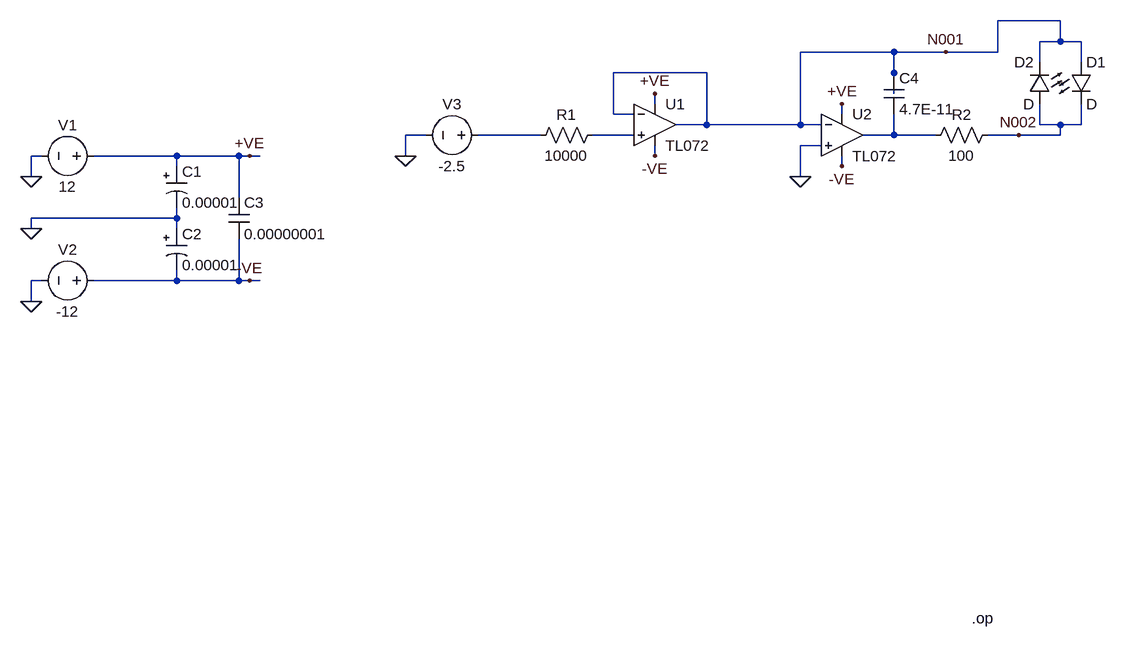
[diagram p0: schematic LED driver.asc]
LED driver.asc, the LTspice schematic file:
Version 4
SHEET 1 1756 888
WIRE 1616 -48 1568 -48
WIRE 1664 -48 1616 -48
WIRE 1664 -16 1664 -48
WIRE 1664 -16 1632 -16
WIRE 1696 -16 1664 -16
WIRE 1408 0 1264 0
WIRE 1488 0 1408 0
WIRE 1568 0 1568 -48
WIRE 1568 0 1488 0
WIRE 1632 16 1632 -16
WIRE 1696 16 1696 -16
WIRE 1120 32 976 32
WIRE 1408 32 1408 0
WIRE 1408 64 1408 32
WIRE 1040 80 1040 64
WIRE 976 96 976 32
WIRE 1008 96 976 96
WIRE 1328 96 1328 80
WIRE 1120 112 1120 32
WIRE 1120 112 1072 112
WIRE 1264 112 1264 0
WIRE 1264 112 1120 112
WIRE 1296 112 1264 112
WIRE 1632 112 1632 80
WIRE 1664 112 1632 112
WIRE 1696 112 1696 80
WIRE 1696 112 1664 112
WIRE 688 128 656 128
WIRE 864 128 768 128
WIRE 1008 128 944 128
WIRE 1408 128 1408 96
WIRE 1408 128 1360 128
WIRE 1472 128 1408 128
WIRE 1600 128 1552 128
WIRE 1616 128 1600 128
WIRE 1664 128 1664 112
WIRE 1664 128 1616 128
WIRE 1296 144 1264 144
WIRE 96 160 80 160
WIRE 304 160 176 160
WIRE 400 160 304 160
WIRE 416 160 400 160
WIRE 432 160 416 160
WIRE 656 160 656 128
WIRE 1040 160 1040 144
WIRE 304 176 304 160
WIRE 1328 176 1328 160
WIRE 80 192 80 160
WIRE 1264 192 1264 144
WIRE 400 224 400 160
WIRE 304 256 304 240
WIRE 304 256 80 256
WIRE 80 272 80 256
WIRE 304 272 304 256
WIRE 96 352 80 352
WIRE 304 352 304 336
WIRE 304 352 176 352
WIRE 400 352 400 288
WIRE 400 352 304 352
WIRE 416 352 400 352
WIRE 432 352 416 352
WIRE 80 384 80 352
FLAG 80 192 0
FLAG 80 384 0
FLAG 80 272 0
FLAG 416 160 +VE
FLAG 416 352 -VE
FLAG 656 160 0
FLAG 1328 80 +VE
FLAG 1328 176 -VE
FLAG 1040 64 +VE
FLAG 1040 160 -VE
FLAG 1264 192 0
FLAG 1488 0 N001
FLAG 1600 128 N002
DATAFLAG 1616 128 "$"
DATAFLAG 1616 -48 "$"
SYMBOL voltage 192 160 R90
WINDOW 0 -32 56 VBottom 2
WINDOW 3 32 56 VTop 2
SYMATTR InstName V1
SYMATTR Value 12
SYMBOL voltage 192 352 R90
WINDOW 0 -32 56 VBottom 2
WINDOW 3 32 56 VTop 2
SYMATTR InstName V2
SYMATTR Value -12
SYMBOL polcap 288 176 R0
WINDOW 3 24 56 Left 2
SYMATTR Value 0.00001
SYMATTR InstName C1
SYMATTR Description Capacitor
SYMATTR Type cap
SYMATTR SpiceLine mfg="   ---" pn="   ---" type="   ---"
SYMBOL polcap 288 272 R0
WINDOW 3 24 56 Left 2
SYMATTR Value 0.00001
SYMATTR InstName C2
SYMATTR Description Capacitor
SYMATTR Type cap
SYMATTR SpiceLine mfg="   ---" pn="   ---" type="   ---"
SYMBOL cap 384 224 R0
SYMATTR InstName C3
SYMATTR Value 0.00000001
SYMBOL res 960 112 R90
WINDOW 0 0 56 VBottom 2
WINDOW 3 32 56 VTop 2
SYMATTR InstName R1
SYMATTR Value 10000
SYMBOL voltage 784 128 R90
WINDOW 0 -32 56 VBottom 2
WINDOW 3 32 56 VTop 2
SYMATTR InstName V3
SYMATTR Value -2.5
SYMBOL cap 1392 32 R0
SYMATTR InstName C4
SYMATTR Value 4.7E-11
SYMATTR SpiceLine mfg=" ---" pn=" ---" type=" ---"
SYMBOL res 1568 112 R90
WINDOW 0 0 56 VBottom 2
WINDOW 3 32 56 VTop 2
SYMATTR InstName R2
SYMATTR Value 100
SYMBOL LED 1680 16 R0
SYMATTR InstName D1
SYMBOL LED 1648 80 R180
WINDOW 0 24 64 Left 2
WINDOW 3 24 0 Left 2
SYMATTR InstName D2
SYMBOL TL072 1040 48 R0
SYMATTR InstName U1
SYMBOL TL072 1328 64 R0
SYMATTR InstName U2
TEXT 1528 872 Left 2 !.op

The netlist it stands for:
* LED driver.asc
V1 +VE 0 12
V2 -VE 0 -12
C1 +VE 0 0.00001 mfg="   ---" pn="   ---" type="   ---"
C2 0 -VE 0.00001 mfg="   ---" pn="   ---" type="   ---"
C3 +VE -VE 0.00000001
R1 N004 N003 10000
V3 N003 0 -2.5
C4 N001 N005 4.7E-11 mfg=" ---" pn=" ---" type=" ---"
R2 N002 N005 100
D1 N001 N002 D
D2 N002 N001 D
* U1: TL072 (symbol TL072 not available, pins judged from their places): In+=N004 In-=N001 V+=+VE V-=-VE OUT=N001
* U2: TL072 (symbol TL072 not available, pins judged from their places): In+=0 In-=N001 V+=+VE V-=-VE OUT=N005
.model D D
.lib standard.dio
.op
.backanno
.end